# Altium schematic sheet MCU_STM32F407VGT6.SchDoc: STM32F446 CNC
size B; Author: AM; CompanyName: Expatria Technologies; DrawnBy: A.Marles; Engineer: AM; Organization: Expatria Technologies; DocumentNumber: 3; SheetNumber: 3; SheetTotal: 14
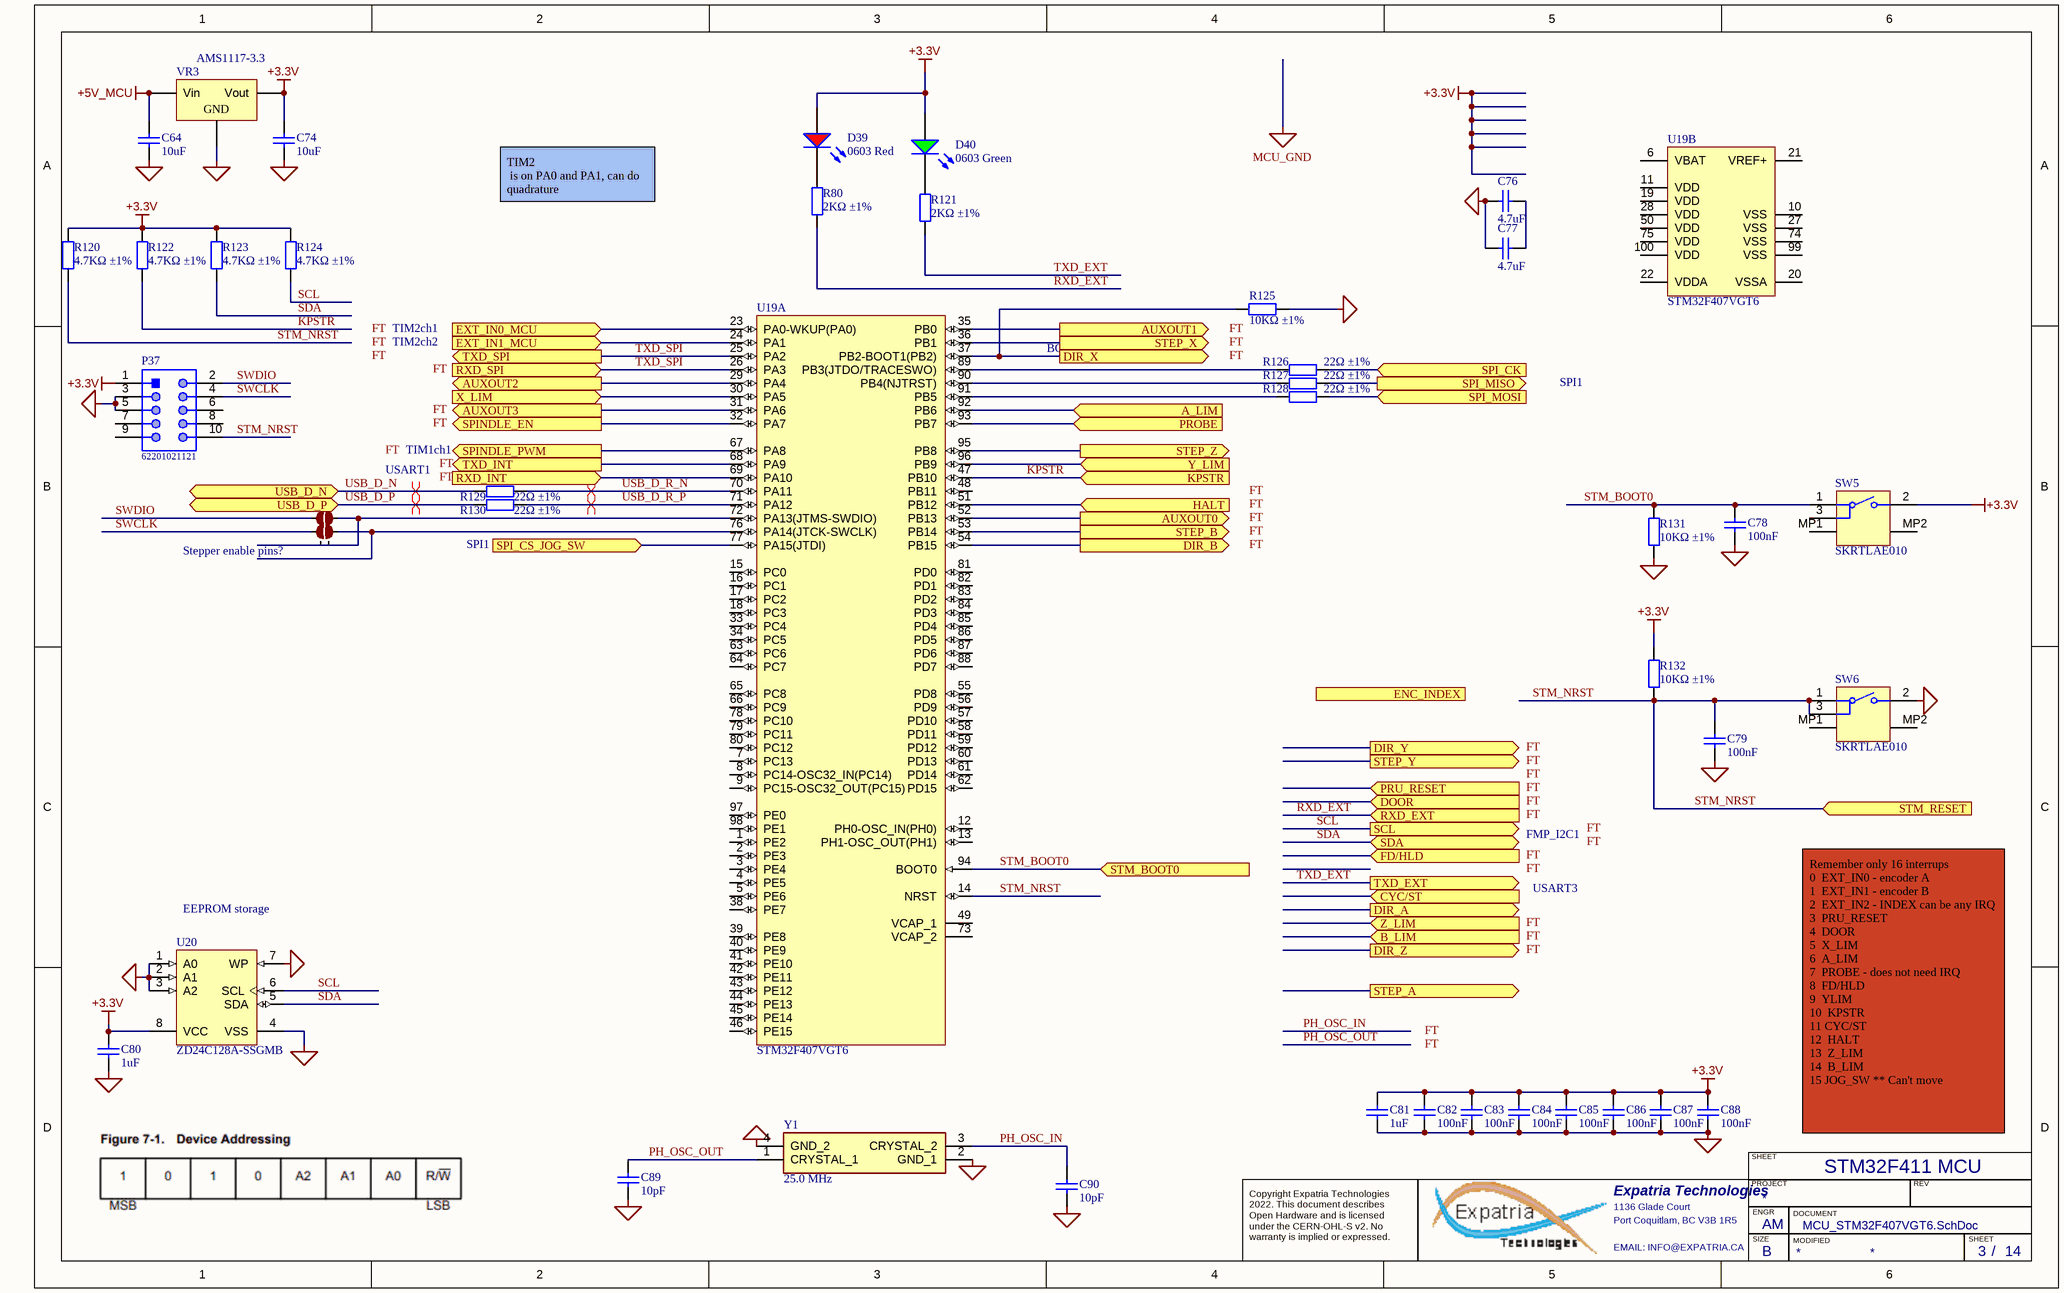
[diagram p0: MCU_STM32F407VGT6.SchDoc]

## Parts
C64  10uF  [1206_C]
C74  10uF  [1206_C]
C76  4.7uF  [0603_C]
C77  4.7uF  [0603_C]
C78  100nF  [0603_C]
C79  100nF  [0603_C]
C80  1uF  [0603_C]
C81  1uF  [0603_C]
C82  100nF  [0603_C]
C83  100nF  [0603_C]
C84  100nF  [0603_C]
C85  100nF  [0603_C]
C86  100nF  [0603_C]
C87  100nF  [0603_C]
C88  100nF  [0603_C]
C89  10pF  [0603_C]
C90  10pF  [0603_C]
D39  0603 Red  [0603_LED_S1]
D40  0603 Green  [0603_LED_S1]
J14  2 way net solder junction - Normally Open  [2waySolder_NO]  (value not drawn)  (no BOM)
J15  2 way net solder junction - Normally Open  [2waySolder_NO]  (value not drawn)  (no BOM)
P37  62201021121  [62201021121]  (no BOM)
R80  2KΩ ±1%  [0603_R]
R120  4.7KΩ ±1%  [0603_R]
R121  2KΩ ±1%  [0603_R]
R122  4.7KΩ ±1%  [0603_R]
R123  4.7KΩ ±1%  [0603_R]
R124  4.7KΩ ±1%  [0603_R]
R125  10KΩ ±1%  [0603_R]
R126  22Ω ±1%  [0603_R]
R127  22Ω ±1%  [0603_R]
R128  22Ω ±1%  [0603_R]
R129  22Ω ±1%  [0603_R]
R130  22Ω ±1%  [0603_R]
R131  10KΩ ±1%  [0603_R]
R132  10KΩ ±1%  [0603_R]
SW5  SKRTLAE010  [ALPS-SKRTLAE010_V]
SW6  SKRTLAE010  [ALPS-SKRTLAE010_V]
U19  STM32F407VGT6  [STM-LQFP100_M]  (parts A,B of 2)
U20  ZD24C128A-SSGMB  [SOIC-SN8_L]
VR3  AMS1117-3.3  [SOT-223]
Y1  25.0 MHz  [YSX321SL]

## Ports
A_LIM (in), AUXOUT0 (out), AUXOUT1 (out), AUXOUT2 (out), AUXOUT3 (out), B_LIM (in), CYC/ST (in), DIR_A (out), DIR_B (out), DIR_X (out), DIR_Y (out), DIR_Z (out), DOOR (in), ENC_INDEX (in), EXT_IN0_MCU (in), EXT_IN1_MCU (in), FD/HLD (in), HALT (in), KPSTR (in), PROBE (in), PRU_RESET (in), RXD_EXT (in), RXD_INT (in), RXD_SPI (in), SCL (out), SDA (bidir), SPI_CK (in), SPI_CS_JOG_SW (in), SPI_MISO (out), SPI_MOSI (in), SPINDLE_EN (out), SPINDLE_PWM (out), STEP_A (out), STEP_B (out), STEP_X (out), STEP_Y (out), STEP_Z (out), STM_BOOT0 (in), STM_RESET (in), TXD_EXT (out), TXD_INT (out), TXD_SPI (out), USB_D_N (bidir), USB_D_P (bidir), X_LIM (in), Y_LIM (in), Z_LIM (in)

## Nets
+3.3V: C74.2 C80.2 C81.2 C82.2 C83.2 C84.2 C85.2 C86.2 C87.2 C88.2 D39.A D40.A P37.1 R120.2 R122.2 R123.2 R124.2 R132.1 SW5.2 U20.8(VCC) VR3.2(Vout)
+5V_MCU: C64.2 VR3.3(Vin)
MCU_GND: C64.1 C74.1 C76.1 C77.1 C78.1 C79.1 C80.1 C81.1 C82.1 C83.1 C84.1 C85.1 C86.1 C87.1 C88.1 C89.1 C90.1 P37.3 P37.5 R125.1 R131.2 SW6.2 U20.1(A0) U20.2(A1) U20.3(A2) U20.4(VSS) U20.7(WP) VR3.1(GND) Y1.2(GND_1) Y1.4(GND_2)
A_LIM: U19.92(PB6) ; port A_LIM
AUXOUT0: U19.52(PB13) ; port AUXOUT0
AUXOUT1: U19.35(PB0) ; port AUXOUT1
AUXOUT2: U19.29(PA4) ; port AUXOUT2
AUXOUT3: U19.31(PA6) ; port AUXOUT3
DIR_B: U19.54(PB15) ; port DIR_B
DIR_X: R125.2 U19.37(PB2-BOOT1(PB2)) ; port DIR_X
EXT_IN0_MCU: U19.23(PA0-WKUP(PA0)) ; port EXT_IN0_MCU
EXT_IN1_MCU: U19.24(PA1) ; port EXT_IN1_MCU
HALT: U19.51(PB12) ; port HALT
KPSTR: R122.1 U19.47(PB10) ; port KPSTR
PH_OSC_IN: C90.2 Y1.3(CRYSTAL_2)
PH_OSC_OUT: C89.2 Y1.1(CRYSTAL_1)
PROBE: U19.93(PB7) ; port PROBE
RXD_EXT: R80.1 ; port RXD_EXT
RXD_INT: U19.69(PA10) ; port RXD_INT
SCL: R124.1 U20.6(SCL) ; port SCL
SDA: R123.1 U20.5(SDA) ; port SDA
SPI_CK: R126.2 ; port SPI_CK
SPI_CS_JOG_SW: U19.77(PA15(JTDI)) ; port SPI_CS_JOG_SW
SPI_MISO: R127.2 ; port SPI_MISO
SPI_MOSI: R128.2 ; port SPI_MOSI
SPINDLE_EN: U19.32(PA7) ; port SPINDLE_EN
SPINDLE_PWM: U19.67(PA8) ; port SPINDLE_PWM
STEP_B: U19.53(PB14) ; port STEP_B
STEP_X: U19.36(PB1) ; port STEP_X
STEP_Z: U19.95(PB8) ; port STEP_Z
STM_BOOT0: C78.2 R131.1 SW5.1 U19.94(BOOT0) ; port STM_BOOT0
STM_NRST: C79.2 P37.10 R120.1 R132.2 SW6.1 SW6.3 U19.14(NRST) ; port STM_RESET
SWCLK: J15.1 P37.4
SWDIO: J14.1 P37.2
TXD_EXT: R121.1 ; port TXD_EXT
TXD_INT: U19.68(PA9) ; port TXD_INT
TXD_SPI: U19.25(PA2) U19.26(PA3) ; port TXD_SPI, port RXD_SPI
USB_D_N: R129.2 ; port USB_D_N
USB_D_P: R130.2 ; port USB_D_P
USB_D_R_N: R129.1 U19.70(PA11)
USB_D_R_P: R130.1 U19.71(PA12)
X_LIM: U19.30(PA5) ; port X_LIM
Y_LIM: U19.96(PB9) ; port Y_LIM
NetC76_2: C76.2 C77.2
NetD39_K: D39.K R80.2
NetD40_K: D40.K R121.2
NetJ14_2: J14.2 U19.72(PA13(JTMS-SWDIO))
NetJ15_2: J15.2 U19.76(PA14(JTCK-SWCLK))
NetR126_1: R126.1 U19.89(PB3(JTDO/TRACESWO))
NetR127_1: R127.1 U19.90(PB4(NJTRST))
NetR128_1: R128.1 U19.91(PB5)

Not connected (* = marked no-connect by the designer): P37 6 7 8 9; SW5 3 MP1 MP2; SW6 MP1 MP2; U19 1(PE2) 2(PE3) 3(PE4) 4(PE5) 5(PE6) 6(VBAT) 7(PC13) 8(PC14-OSC32_IN(PC14)) 9(PC15-OSC32_OUT(PC15)) 10(VSS) 11(VDD) 12(PH0-OSC_IN(PH0)) 13(PH1-OSC_OUT(PH1)) 15(PC0) 16(PC1) 17(PC2) 18(PC3) 19(VDD) 20(VSSA) 21(VREF+) 22(VDDA) 27(VSS) 28(VDD) 33(PC4) 34(PC5) 38(PE7) 39(PE8) 40(PE9) 41(PE10) 42(PE11) 43(PE12) 44(PE13) 45(PE14) 46(PE15) 48(PB11) 49(VCAP_1) 50(VDD) 55(PD8) 56(PD9) 57(PD10) 58(PD11) 59(PD12) 60(PD13) 61(PD14) 62(PD15) 63(PC6) 64(PC7) 65(PC8) 66(PC9) 73(VCAP_2) 74(VSS) 75(VDD) 78(PC10) 79(PC11) 80(PC12) 81(PD0) 82(PD1) 83(PD2) 84(PD3) 85(PD4) 86(PD5) 87(PD6) 88(PD7) 97(PE0) 98(PE1) 99(VSS) 100(VDD)

## Layout directives
differential pair: USB_D_N, USB_D_P, USB_D_R_N, USB_D_R_P

## Notes on the sheet
- TIM2
  is on PA0 and PA1, can do quadrature
- FT
- TIM2ch1
- TIM2ch2
- BOOT1
- (near R125) FT
- SPI1
- USART1
- TIM1ch1
- Stepper enable pins?
- FMP_I2C1
- (near U20) EEPROM storage
- USART3
- Remember only 16 interrups
  0  EXT_IN0 - encoder A
  1  EXT_IN1 - encoder B
  2  EXT_IN2 - INDEX can be any IRQ
  3  PRU_RESET
  4  DOOR
  5  X_LIM
  6  A_LIM
  7  PROBE - does not need IRQ
  8  FD/HLD
  9  YLIM
  10  KPSTR
  11 CYC/ST
  12  HALT
  13  Z_LIM
  14  B_LIM
  15 JOG_SW ** Can't move
- STM32F411 MCU
- SHEET
- Expatria Technologies
- 1136 Glade Court
- Port Coquitlam, BC V3B 1R5
- PROJECT
- SIZE
- ENGR
- MODIFIED
- DOCUMENT
- REV
- Copyright Expatria Technologies 2022. This document describes Open Hardware and is licensed under the CERN-OHL-S v2. No warranty is implied or expressed.
- EMAIL: INFO@EXPATRIA.CA
- B
- /

## Library data of the parts
C64 C74 = 1206 10uF (106) 10% 50V: Chip capacitors; Manufacturer: Samsung Electro-Mechanics; PartNumber: CL31A106KBHNNNE; Tolerance: 10%; Voltage: 50V; ComponentLink1Description: Supplier link; ComponentLink1URL: http://www.szlcsc.com/product/details_14236.html; Package: 1206; Supplier: LC; SuppliersPartNumber: C13585; Capacitance: 10uF; Manufacturer 1: Samsung Electro-Mechanics
C76 C77 = 0603 4.7uF (475) 10% 16V: Chip capacitors; Manufacturer: Samsung Electro-Mechanics; PartNumber: CL10A475KO8NNNC; Tolerance: 10%; Voltage: 16V; ComponentLink1Description: Supplier link; ComponentLink1URL: http://www.szlcsc.com/product/details_20375.html; Package: 0603; Supplier: LC; SuppliersPartNumber: C19666; Capacitance: 4.7uF
C78 C79 C82-C88 = 0603 100nF (104) 10% 50V: Chip capacitors; Manufacturer: YAGEO; PartNumber: CC0603KRX7R9BB104; Tolerance: 10%; Voltage: 50V; ComponentLink1Description: Supplier link; ComponentLink1URL: http://www.szlcsc.com/product/details_15331.html; Package: 0603; Supplier: LC; SuppliersPartNumber: C14663; Capacitance: 100nF
C80 C81 = 0603 1uF (105) 10% 50V: Chip capacitors; Manufacturer: Samsung Electro-Mechanics; PartNumber: CL10A105KB8NNNC; Tolerance: 10%; Voltage: 50V; Package: 0603; Supplier: LC; SuppliersPartNumber: C15849; Capacitance: 1uF; ComponentLink1Description: Supplier link; ComponentLink1URL: http://www.szlcsc.com/product/details_16531.html
C89 C90 = 0603 10pF (100) 5% 50V: Chip capacitors; Manufacturer: Samsung Electro-Mechanics; PartNumber: CL10C100JB8NNNC; Tolerance: 5%; Voltage: 50V; ComponentLink1Description: Supplier link; ComponentLink1URL: http://www.szlcsc.com/product/details_1986.html; Package: 0603; Supplier: LC; SuppliersPartNumber: C1634; Capacitance: 10pF
D39 = 0603 LED Red: LED; ComponentLink1Description: 供应商链接; ComponentLink1URL: http://www.szlcsc.com/product/details_2659.html; Package: 0603; Supplier: LC; SuppliersPartNumber: C2286; Color: Red
D40 = 0603 LED Green: LED; ComponentLink1Description: 供应商链接; ComponentLink1URL: http://www.szlcsc.com/product/details_73152.html; Package: 0603; Supplier: LC; SuppliersPartNumber: C72043; Color: Green
J14 J15 = 2waySolderNO: ComponentLink1URL: http://www.edatools.cz/addons; ComponentLink1Description: Source
P37 = CMP-1502-00948-1: THT Vertical Pin Header WR-PHD, Pitch 1.27 mm, Dual Row, 10 pins; Manufacturer: Wurth Elektronik; Rated Current: 1A; Pin Number: 10; Working Voltage: 100VAC; Contact Resistance: 20mOhm; Withstanding Voltage: 500VAC; Pitch: 1.27mm; Gender: Male; Mounting Technology: THT; Manufacturer URL: http://www.we-online.de; Package Reference: 62201021121; Row Number: Dual; Datasheet URL: https://katalog.we-online.de/em/datasheet/62201021121.pdf; Publisher: WurthElektronik; Packaging: Box; Operating Temperature: -40to105degC; Orientation: Vertical; Part Number: 62201021121
R80 R121 = 0603 2K (2001) 1%: Chip resistor; Manufacturer: Uniroyal Elec; PartNumber: 0603WAF2001T5E; Power: 1/10W; ComponentLink1Description: Supplier link; ComponentLink1URL: http://www.szlcsc.com/product/details_23702.html; Package: 0603; Supplier: LC; SuppliersPartNumber: C22975; Resistance: 2KΩ; Tolerance: 1%
R120 R122-R124 = 0603 4.7K (4701) 1%: Chip resistor; Manufacturer: Uniroyal Elec; PartNumber: 0603WAF4701T5E; Power: 1/10W; ComponentLink1Description: Supplier link; ComponentLink1URL: http://www.szlcsc.com/product/details_23889.html; Package: 0603; Supplier: LC; SuppliersPartNumber: C23162; Resistance: 4.7KΩ; Tolerance: 1%
R125 R131 R132 = 0603 10K (1002) 1%: Chip resistor; Manufacturer: Uniroyal Elec; PartNumber: 0603WAF1002T5E; Power: 1/10W; ComponentLink1Description: Supplier link; ComponentLink1URL: http://www.szlcsc.com/product/details_26547.html; Package: 0603; Supplier: LC; SuppliersPartNumber: C25804; Resistance: 10KΩ; Tolerance: 1%
R126-R130 = 0603 22R (22R0) 1%: Chip resistor; Manufacturer: Uniroyal Elec; PartNumber: 0603WAF220JT5E; Power: 1/10W; ComponentLink1Description: Supplier link; ComponentLink1URL: http://www.szlcsc.com/product/details_24078.html; Package: 0603; Supplier: LC; SuppliersPartNumber: C23345; Resistance: 22Ω; Tolerance: 1%
SW5 SW6 = CMP-2000-07073-2: Side Push Type, 250 V, -40 to 90 degC, 3-Pin SMD, RoHS, Tape and Reel; Manufacturer: ALPS; Operating Force: 1.6N; Folder: Unified Components\Components\New Releases\New\; Maximum Current Rating: 0.05@12VDCA; RevisionId: 1; Pole Throw Configuration: SPST; Switch Configuration: N.O.; AccessRights: 2147483647; Maximum DC Voltage Rating: 12V; ContentType: Unified Component; Rad Hard: No; Mounting: SurfaceMount; Datasheet URL: http://www.alps.com/prod/info/E/PDF/Tact/SurfaceMount/SKRT/SKRT.PDF; Manufacturer URL: http://www.alps.com/e/; ReleaseDate: 22/09/2017 06:13:25 AM; ItemHRID: CMP-2000-07073; ContentTypeGUID: CB3C11C4-E317-11DF-B822-12313F0024A2; LifeCycle: Released; ItemGUID: EAC55BEC-37DC-4BDB-8BA7-D75E6D5C3D75; Packaging: Tape&Reel; Package Reference: SKRTLAE010; FolderGUID: B7F4506A-9127-42E7-A087-46FE7B18D116; Datasheet Version: 06/2015; Mounting Technology: SurfaceMount; LifeCycleStateGUID: 61E382EE-6656-4F12-9E24-BE9327104A25; Package Description: 3-Pin Surface Mount Device, Body 4.5 x 3.55 mm, Pitch 1.225 mm; SuppliersPartNumber: C110293; Manufacturer 1: ALPS
U19 = CMP-0243-00017-3: ARM Cortex-M4 32-bit MCU+FPU, 210 DMIPS, 1024 kB Flash, 192 kB Internal RAM, 82 I/Os, 100-pin LQFP, -40 to 85 degC, Tray; Manufacturer: STMicroelectronics; Supply Voltage(Vcc) min (V): 1.8; Supply Voltage(Vcc) max (V): 3.6; I/Os (High Current): 82; Operating Frequency(F) (Processor speed) (MHz): 168; D/A Converter: 2x12-bit; FLASH Size (Prog) (kB): 1024; Internal RAM Size (kB): 192; PackageDescription: 100-Pin Low Profile Quad Flat Package, 14 x 14 mm Body, 0.5 mm Pitch; ComponentLink3URL: http://www.st.com/st-web-ui/static/active/en/resource/technical/document/data_brief/DM00071938.pdf; PackageVersion: Rev. 1, 06/2013; PackageReference: LQFP100; PartNumber: STM32F407VGT6; ComponentLink1Description: Manufacturer URL; ComponentLink2URL: http://www.st.com/st-web-ui/static/active/en/resource/technical/document/datasheet/DM00037051.pdf; DatasheetVersion: Rev. 4; ComponentLink3Description: Package Specification; Core: ARM Cortex-M4; ComponentLink2Description: Datasheet; Mounting Technology: Surface Mount; ComponentLink1URL: http://www.st.com/web/en/home.html; Packing: Tray
U20 = CMP-0159-00216-1: IC EEPROM 128KBIT I2C 8SOIC; SuppliersPartNumber: C918271
VR3 = SOT-223 AMS1117-3.3: Vout=3.3V 1A 72dB@(120Hz) (LDO); Manufacturer 1: AMS; ComponentLink1Description: 供应商链接; ComponentLink1URL: http://www.szlcsc.com/product/details_6652.html; Package: SOT-223; Supplier: LC; SuppliersPartNumber: C6186; Manufacturer Part Number 1: AMS1117-3.3
Y1 = YSX321SL: Crystal or Oscillator; Manufacturer_Name: Yangxing Tech; Manufacturer_Part_Number: X322525MSB4SI; Height: 0.8mm; SuppliersPartNumber: C13740